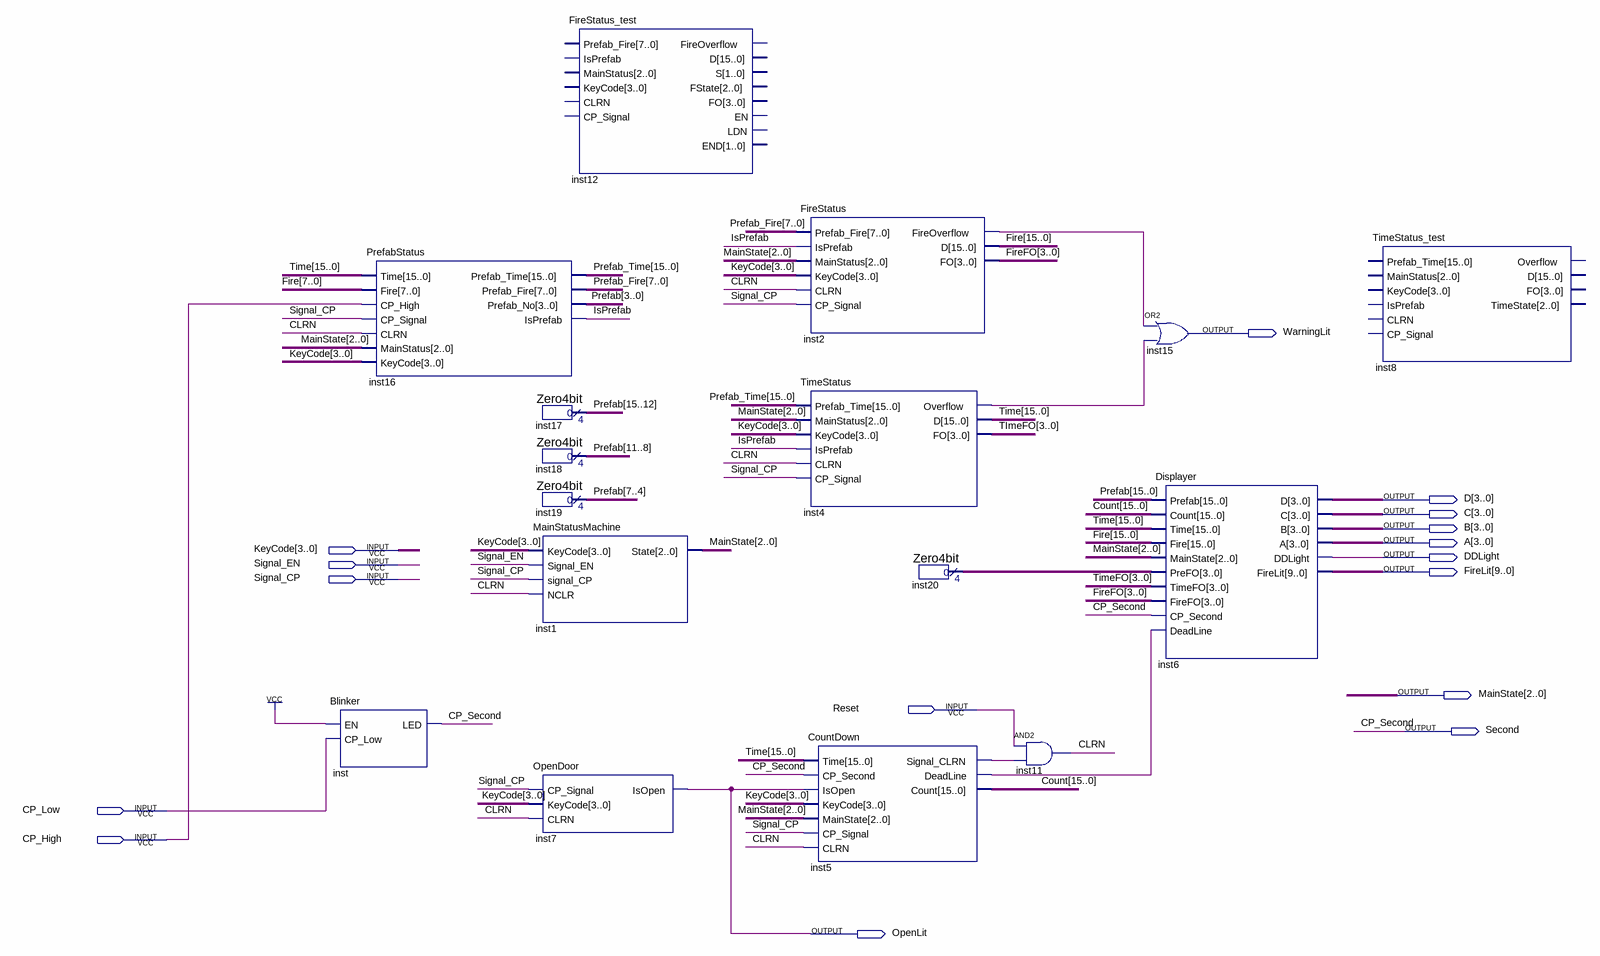
[diagram p0: schematic sheet]
// Quartus schematic Microwave_test.bdf as structural Verilog: 16 symbols, 16 pins
module Microwave_test (
  input  [3:0] KeyCode,
  input  Signal_EN,
  input  Signal_CP,
  input  Reset,
  input  CP_Low,
  input  CP_High,
  output WarningLit,
  output [3:0] D,
  output [3:0] C,
  output [3:0] B,
  output [3:0] A,
  output DDLight,
  output [9:0] FireLit,
  output [2:0] MainState,
  output Second,
  output OpenLit
);

  wire CLRN, inst2_fireoverflow, inst4_overflow, inst5_deadline, inst5_signal_clrn, IsPrefab;
  wire [3:0] FireFO, inst20_result, TimeFO;
  wire [7:0] Prefab_Fire;
  wire [15:0] Count, Fire, Prefab, Prefab_Time, Time;

  Blinker inst (.EN(1'b1), .CP_Low(CP_Low), .LED(Second));
  PrefabStatus inst16 (
    .Time(Time), .Fire(Fire[7:0]), .CP_High(CP_High), .CP_Signal(Signal_CP), .CLRN(CLRN),
    .MainStatus(MainState), .KeyCode(KeyCode), .Prefab_Time(Prefab_Time), .Prefab_Fire(Prefab_Fire),
    .Prefab_No(Prefab[3:0]), .IsPrefab(IsPrefab));
  FireStatus_test inst12 ();  // open: Prefab_Fire, IsPrefab, MainStatus, KeyCode, CLRN, CP_Signal, FireOverflow, D, S, FState, FO, EN, LDN, END
  Zero4bit inst17 (.result(Prefab[15:12]));
  Zero4bit inst18 (.result(Prefab[11:8]));
  Zero4bit inst19 (.result(Prefab[7:4]));
  MainStatusMachine inst1 (
    .KeyCode(KeyCode), .Signal_EN(Signal_EN), .signal_CP(Signal_CP), .NCLR(CLRN), .State(MainState));
  OpenDoor inst7 (.CP_Signal(Signal_CP), .KeyCode(KeyCode), .CLRN(CLRN), .IsOpen(OpenLit));
  FireStatus inst2 (
    .Prefab_Fire(Prefab_Fire), .IsPrefab(IsPrefab), .MainStatus(MainState), .KeyCode(KeyCode), .CLRN(CLRN),
    .CP_Signal(Signal_CP), .FireOverflow(inst2_fireoverflow), .D(Fire), .FO(FireFO));
  TimeStatus inst4 (
    .Prefab_Time(Prefab_Time), .MainStatus(MainState), .KeyCode(KeyCode), .IsPrefab(IsPrefab), .CLRN(CLRN),
    .CP_Signal(Signal_CP), .Overflow(inst4_overflow), .D(Time), .FO(TimeFO));
  CountDown inst5 (
    .Time(Time), .CP_Second(Second), .IsOpen(OpenLit), .KeyCode(KeyCode), .MainState(MainState),
    .CP_Signal(Signal_CP), .CLRN(CLRN), .Signal_CLRN(inst5_signal_clrn), .DeadLine(inst5_deadline),
    .Count(Count));
  Zero4bit inst20 (.result(inst20_result));
  and inst11 (CLRN, Reset, inst5_signal_clrn);
  or inst15 (WarningLit, inst2_fireoverflow, inst4_overflow);
  Displayer inst6 (
    .Prefab(Prefab), .Count(Count), .Time(Time), .Fire(Fire), .MainState(MainState), .PreFO(inst20_result),
    .TimeFO(TimeFO), .FireFO(FireFO), .CP_Second(Second), .DeadLine(inst5_deadline), .D(D), .C(C), .B(B),
    .A(A), .DDLight(DDLight), .FireLit(FireLit));
  TimeStatus_test inst8 ();  // open: Prefab_Time, MainStatus, KeyCode, IsPrefab, CLRN, CP_Signal, Overflow, D, FO, TimeState

  // Other names for the same wires on the sheet: CP_Second = Second
endmodule
